# EAGLE schematic Esquematico_sensores (EAGLE 9.6.2)
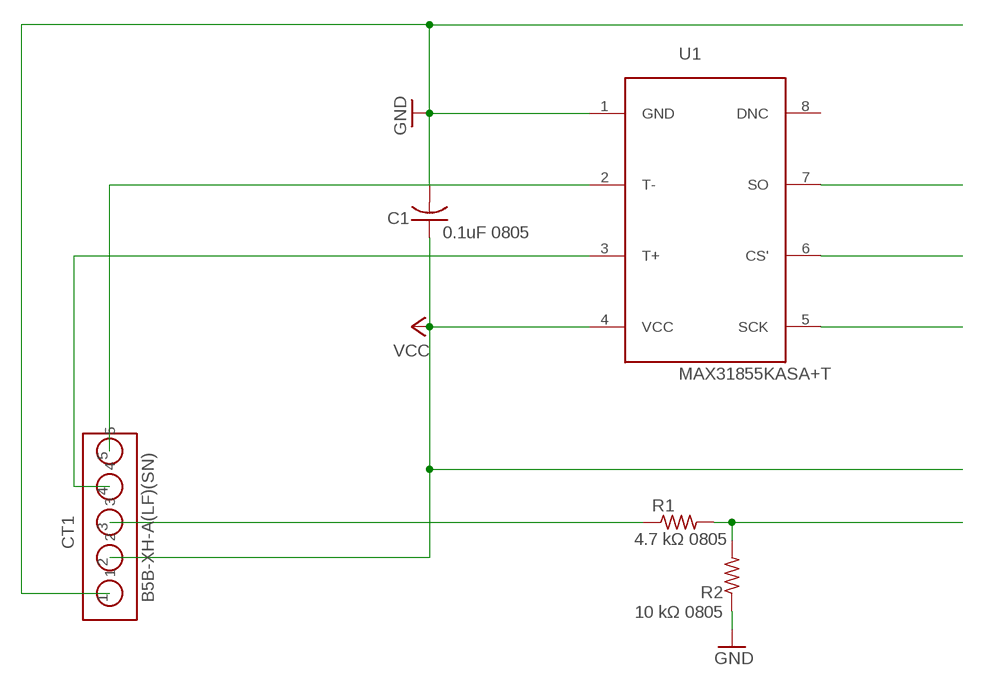
[diagram p0: schematic, sheet 1]

## Parts
C1  0.1uF 0805  C-USC0805  [C0805]
CT1  B5B-XH-A(LF)(SN)  [5-PIN-JST]
R1  4.7 kΩ 0805  R-US_R0805  [R0805]
R2  10 kΩ 0805  R-US_R0805  [R0805]
U1  MAX31855KASA+T  [8-SOIC]

## Nets
GND: C1.2 CT1.1 R2.1 U1.1(GND)
N$1: CT1.3 R1.1
N$2: R1.2 R2.2
N$3: CT1.4 U1.3(T+)
N$4: CT1.5 U1.2(T-)
N$5: U1.7(SO)
N$6: U1.6(CS')
N$7: U1.5(SCK)
VCC: C1.1 CT1.2 U1.4(VCC)
Unconnected: U1.8(DNC)

## Library data of the parts
C1 = rcl:C-US: CAPACITOR, American symbol; PART_NO: GCM21BR72A104KA37L; SPICEPREFIX: C
CT1 = B5B-XH-A(LF)(SN)-JST:B5B-XH-A(LF)(SN); PART_NO: B5B-XH-A(LF)(SN)
R1 = rcl:R-US_: RESISTOR, American symbol; PART_NO: RC0805FR-074K7L; SPICEPREFIX: R
R2 = rcl:R-US_: RESISTOR, American symbol; PART_NO: RC0805FR-0710KL; SPICEPREFIX: R
U1 = MAX31855KASA+T- MAXIM INTEGRATED:MAX31855KASA+T; PART_NO: MAX31855KASA+T